# EAGLE design oresat0-plusz-end-cap (EAGLE 9.6.2)
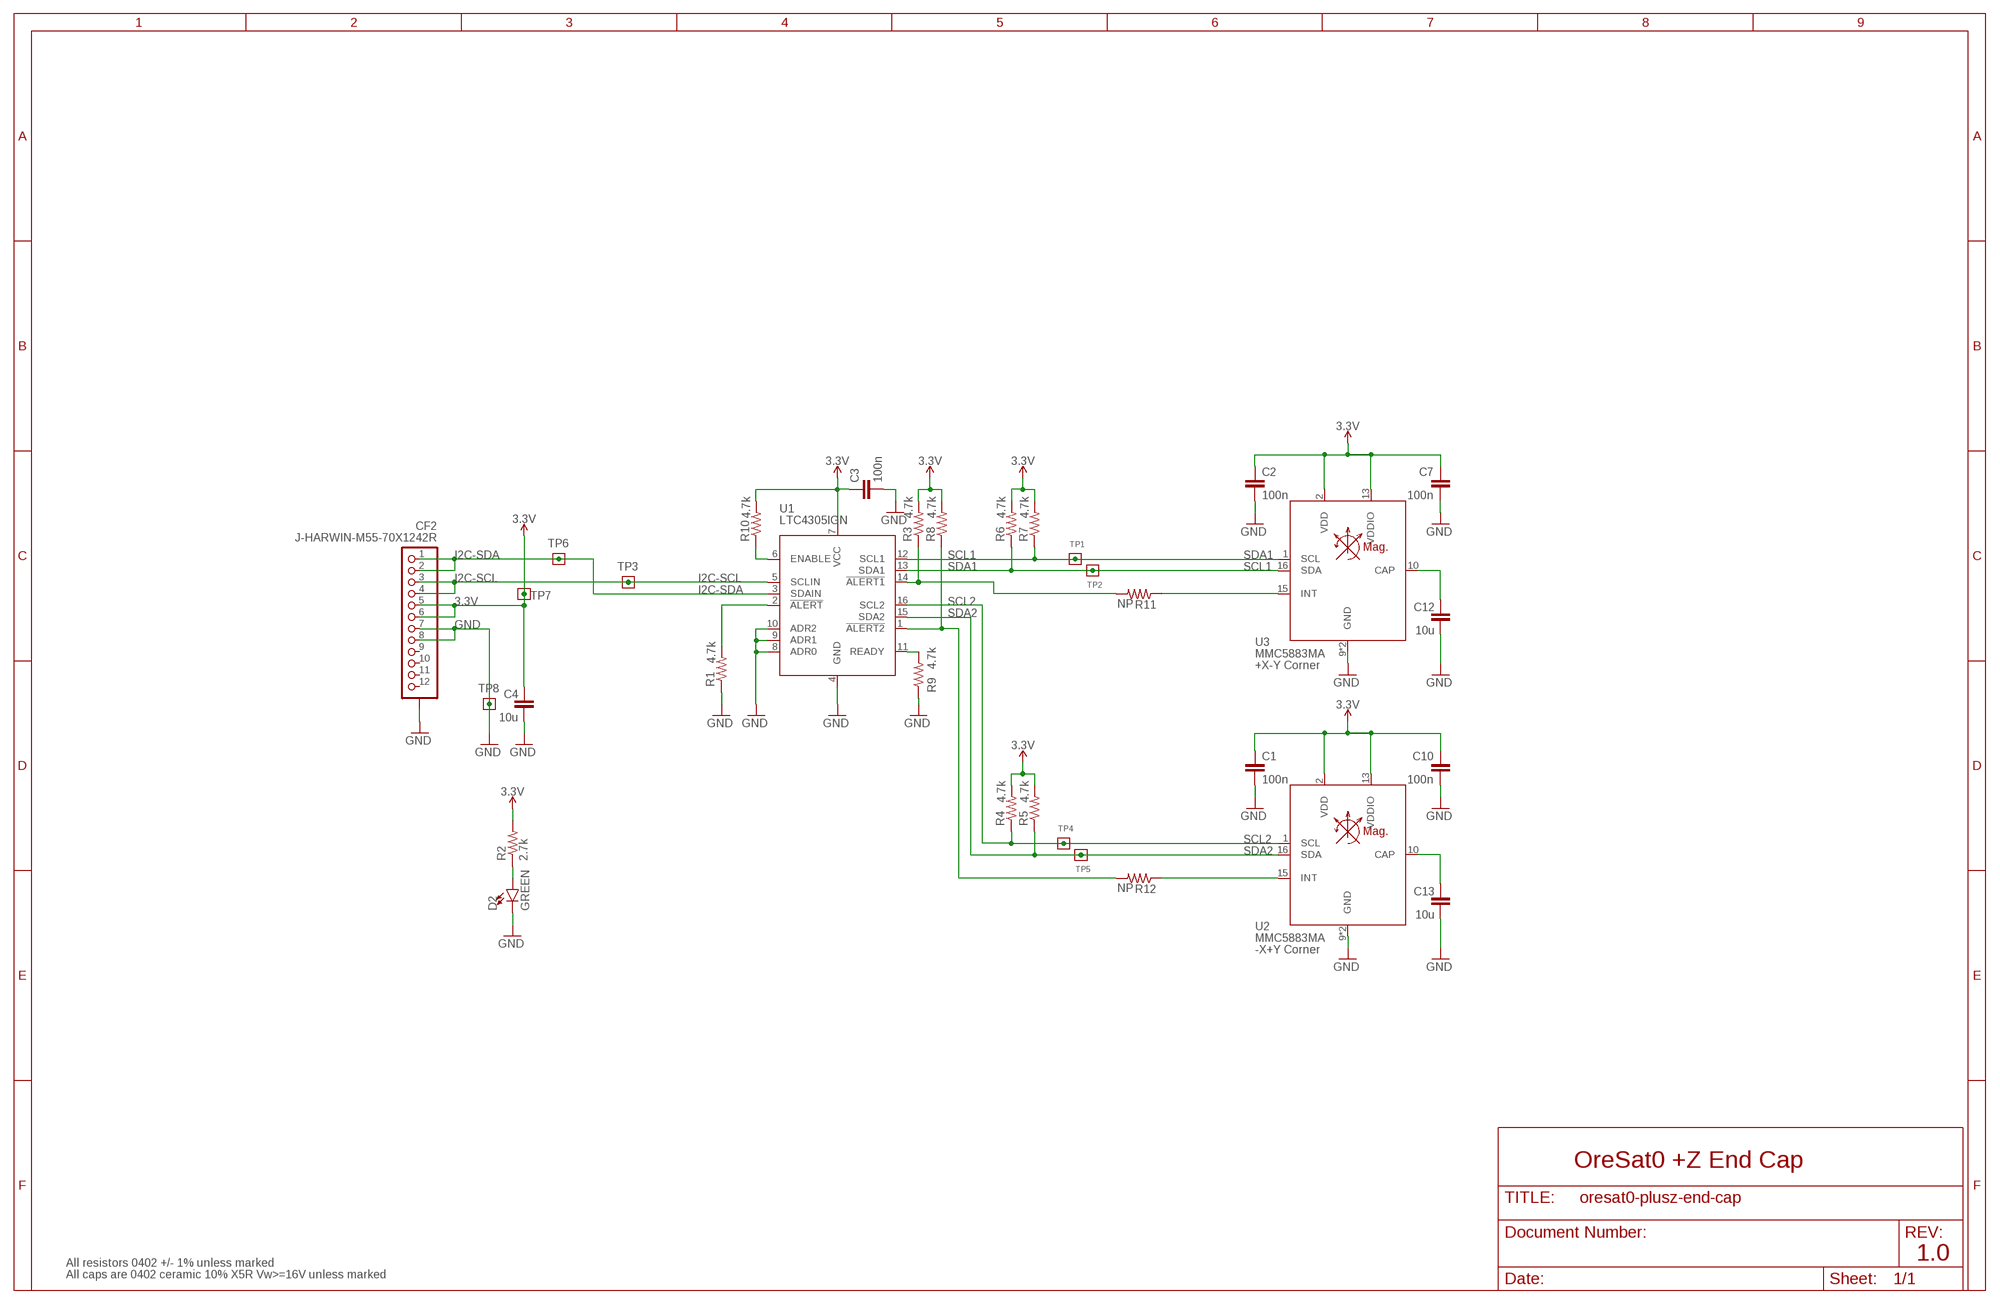
[diagram p0: schematic, sheet 1]

## Parts
C1  100n  C-EU0603-B-NOSILK  [.0603-B-NOSILK]
C2  100n  C-EU0603-B-NOSILK  [.0603-B-NOSILK]
C3  100n  C-EU0603-B-NOSILK  [.0603-B-NOSILK]
C4  10u  C-EU0603-B-NOSILK  [.0603-B-NOSILK]
C7  100n  C-EU0603-B-NOSILK  [.0603-B-NOSILK]
C10  100n  C-EU0603-B-NOSILK  [.0603-B-NOSILK]
C12  10u  C-EU0603-B-NOSILK  [.0603-B-NOSILK]
C13  10u  C-EU0603-B-NOSILK  [.0603-B-NOSILK]
CF2  J-HARWIN-M55-70X1242R  [HARWIN-M55-70X1242R]
D2  GREEN  LED-GREEN0603  [LED-0603]
R1  4.7k  R-US_0603-B-NOSILK  [.0603-B-NOSILK]
R2  2.7k  R-US_0603-B-NOSILK  [.0603-B-NOSILK]
R3  4.7k  R-US_0603-B-NOSILK  [.0603-B-NOSILK]
R4  4.7k  R-US_0603-B-NOSILK  [.0603-B-NOSILK]
R5  4.7k  R-US_0603-B-NOSILK  [.0603-B-NOSILK]
R6  4.7k  R-US_0603-B-NOSILK  [.0603-B-NOSILK]
R7  4.7k  R-US_0603-B-NOSILK  [.0603-B-NOSILK]
R8  4.7k  R-US_0603-B-NOSILK  [.0603-B-NOSILK]
R9  4.7k  R-US_0603-B-NOSILK  [.0603-B-NOSILK]
R10  4.7k  R-US_0603-B-NOSILK  [.0603-B-NOSILK]
R11  NP  R-US_0603-B-NOSILK  [.0603-B-NOSILK]
R12  NP  R-US_0603-B-NOSILK  [.0603-B-NOSILK]
TP1  TEST-POINT-LARGE-SQUARE  [1X01]
TP2  TEST-POINT-LARGE-SQUARE  [1X01]
TP3  TEST-POINT-LARGE-SQUARE  [1X01]
TP4  TEST-POINT-LARGE-SQUARE  [1X01]
TP5  TEST-POINT-LARGE-SQUARE  [1X01]
TP6  TEST-POINT-LARGE-SQUARE  [1X01]
TP7  TEST-POINT-LARGE-SQUARE  [1X01]
TP8  TEST-POINT-LARGE-SQUARE  [1X01]
U1  LTC4305IGN  LTC4305  [16-SSOP]
U2  MMC5883MA  [LGA-16(3X3)]
U3  MMC5883MA  [LGA-16(3X3)]

## Nets
3.3V: C1.1 C2.1 C3.1 C4.1 C7.1 C10.1 CF2.5 CF2.6 R2.2 R3.2 R4.2 R5.2 R6.2 R7.2 R8.2 R10.2 TP7.1 U1.7(VCC) U2.2(VDD) U2.13(VDDIO) U3.2(VDD) U3.13(VDDIO)
GND: C1.2 C2.2 C3.2 C4.2 C7.2 C10.2 C12.2 C13.2 CF2.7 CF2.8 CF2.P$1(SHIELDS) CF2.P$2(SHIELDS) CF2.P$3(SHIELDS) CF2.P$4(SHIELDS) D2.C R1.1 R9.1 TP8.1 U1.4(GND) U1.8(ADR0) U1.9(ADR1) U1.10(ADR2) U2.9(GND) U2.11(GND) U3.9(GND) U3.11(GND)
I2C-SCL: CF2.3 CF2.4 TP3.1 U1.5(SCLIN)
I2C-SDA: CF2.1 CF2.2 TP6.1 U1.3(SDAIN)
N$1: R9.2 U1.11(READY)
N$2: C12.1 U3.10(CAP)
N$3: R1.2 U1.2(!ALERT)
N$4: R3.1 R11.2 U1.14(!ALERT1)
N$5: C13.1 U2.10(CAP)
N$6: R8.1 R12.2 U1.1(!ALERT2)
N$7: R11.1 U3.15(INT)
N$8: R10.1 U1.6(ENABLE)
N$10: R12.1 U2.15(INT)
N$271: D2.A R2.1
SCL1: R7.1 TP1.1 U1.12(SCL1) U3.1(SCL)
SCL2: R4.1 TP4.1 U1.16(SCL2) U2.1(SCL)
SDA1: R6.1 TP2.1 U1.13(SDA1) U3.16(SDA)
SDA2: R5.1 TP5.1 U1.15(SDA2) U2.16(SDA)
Unconnected: CF2.9 CF2.10 CF2.11 CF2.12

## Notes on the sheet
- +X-Y Corner
- -X+Y Corner
- OreSat0 +Z End Cap
- 1.0
- All resistors 0402 +/- 1% unless marked
- All caps are 0402 ceramic 10% X5R Vw>=16V unless marked

## Library data of the parts
C1-C3 C7 C10 = oresat-rcl:C-EU: CAPACITOR, European symbol; DIS: Digi-Key; DPN: 1276-CL10B104KB8NNNLCT-ND; MFR: Samsung; MPN: CL10B104KB8NNNL
C4 C12 C13 = oresat-rcl:C-EU: CAPACITOR, European symbol; DIS: Digi-Key; DPN: 490-14461-1-ND; MFR: Murata; MPN: GRM188D71A106KA73D
CF2 = J-Harwin-M55-70X1242R-12pin-1.27mm-M-vertical:J-HARWIN-M55-70X1242R; DIS: Digi-Key; DPN: A122888-ND; MFR: Harwin; MPN: M55-7011242R
D2 = SparkFun-LED:LED-GREEN: Green SMD LED Used in manufacturing of various products at SparkFun Packages: 0603 - SMD 0603 package [Product Link] <http://www.futureelectronics.com/en/technologies/semiconductors/optoelectronics/leds/Pages/9894312-LTST-C190GKT.aspx?CrossPart=HSMG-C190&IM=0> LilyPad 1206 - SMD1206 LilyPad package [Product Link] <http://www.futureelectronics.com/en/Technologies/Product.aspx?ProductID=IN150NGHARVATEKCORPORATION2049943&IM=0> 1206 - SMD1206 package [Product Link] <http://www.futureelectronics.com/en/technologies/semiconductors/optoelectronics/leds/Pages/8315665-LTST-C150KGKT.aspx?IM=0> 1206 Bottom Mount -SMD 1206 Bottom Mount [Product Link] <http://www.digikey.com/product-detail/en/lite-on-inc/LTST-C230KGKT/160-1456-1-ND/386854> SparkFun Products: Pro Mini 328 -5V <https://www.sparkfun.com/products/821> RedBoard <https://www.sparkfun.com/products/12757> MP3 Trigger <https://www.sparkfun.com/products/13720> Makey Makey <https://www.sparkfun.com/products/11076>; DIS: Digi-Key; DPN: 511-1584-1-ND; MFR: Rohn; MPN: SML-E12M8WT86; PROD_ID: DIO-00821
R1 R3-R10 = oresat-rcl:R-US_: RESISTOR, American symbol; DIS: Digi-Key; DPN: A129696CT-ND; MFR: TE Connectivity; MPN: CRGCQ0603F4K7
R2 = oresat-rcl:R-US_: RESISTOR, American symbol; DIS: Digi-Key; DPN: A129693CT-ND; MFR: TE Connectivity; MPN: CRGCQ0603F2K7
R11 R12 = oresat-rcl:R-US_: RESISTOR, American symbol
TP1-TP8 = oresat-misc:TEST-POINT-LARGE-SQUARE
U1 = U-Linear-LTC4305-2-Channel-Bus-Multiplexer:LTC4305; DIS: Digi-Key; DPN: LTC4305IGN#PBF-ND; MFR: Analog; MPN: LTC4305IGN#PBF
U2 U3 = U-Memsic-MMC5883-3-Axis-Magnetometer:MMC5883MA; DIS: Digi-Key; DPN: 1267-1072-1-ND; MFR: Memsic; MPN: MMC5883MA

## Board
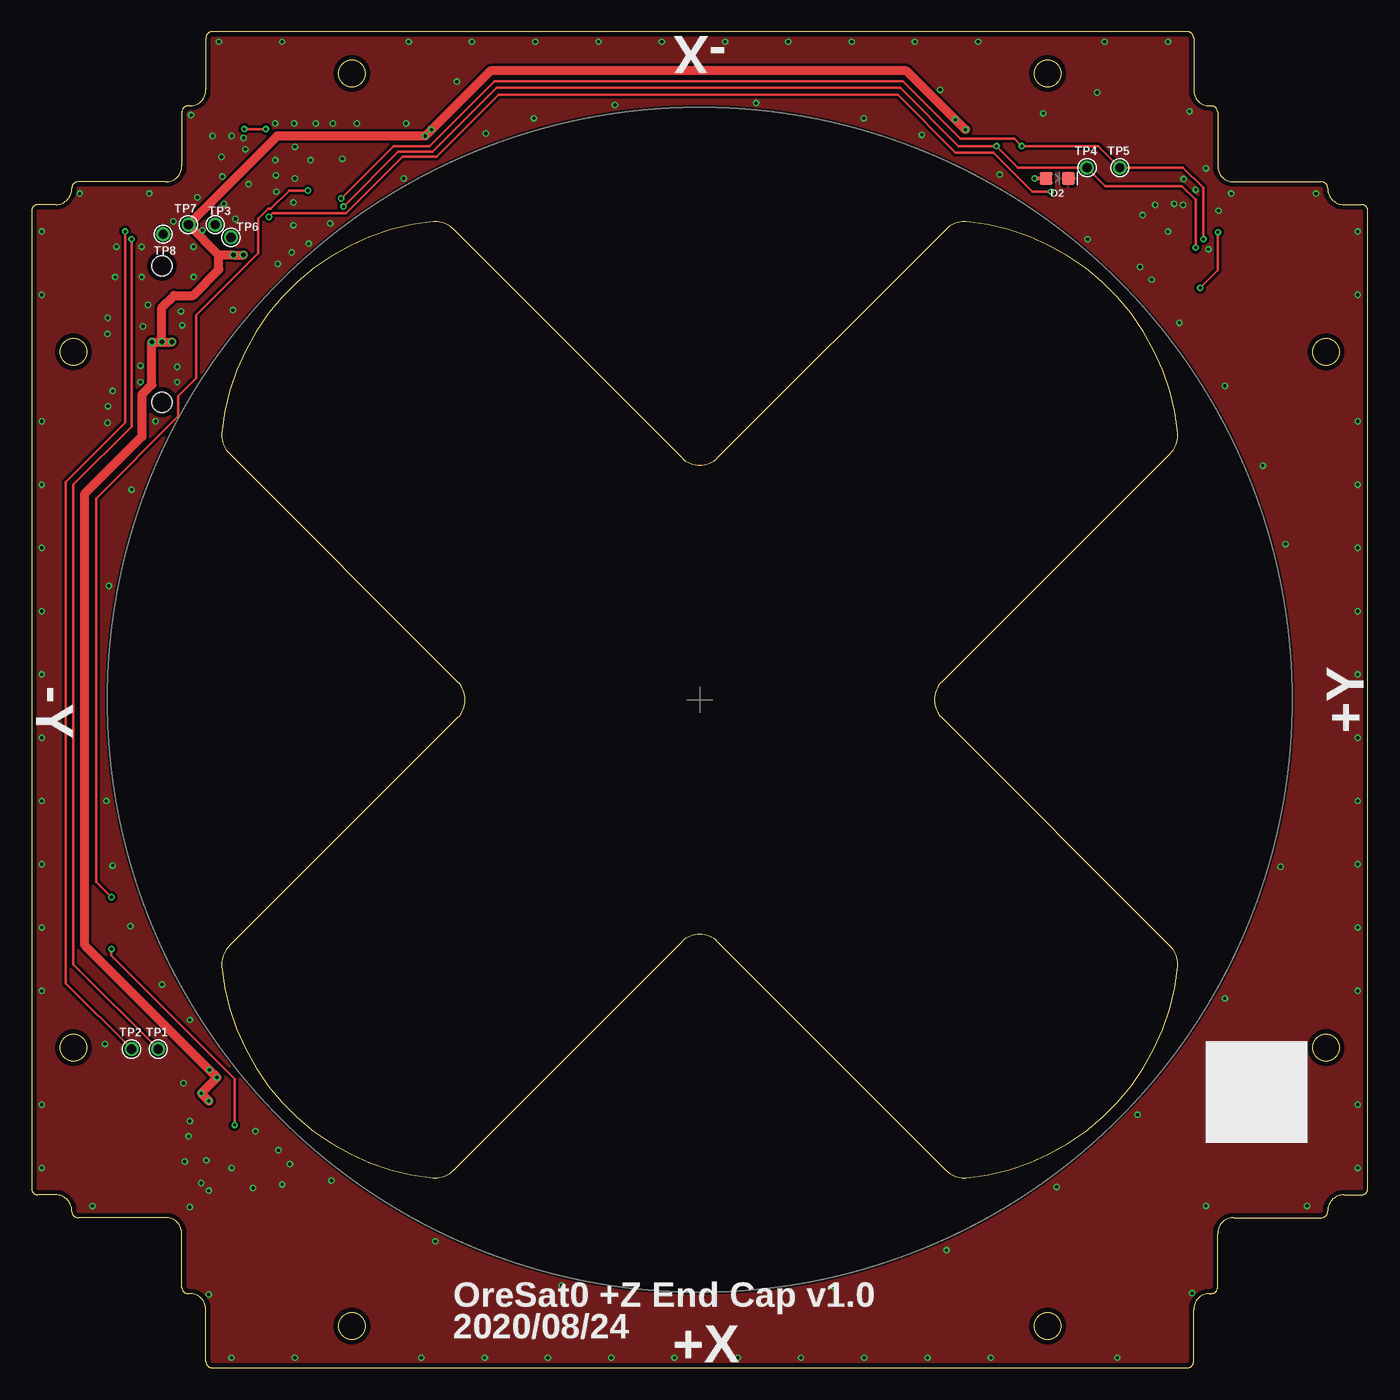
[diagram p1: board, top side]
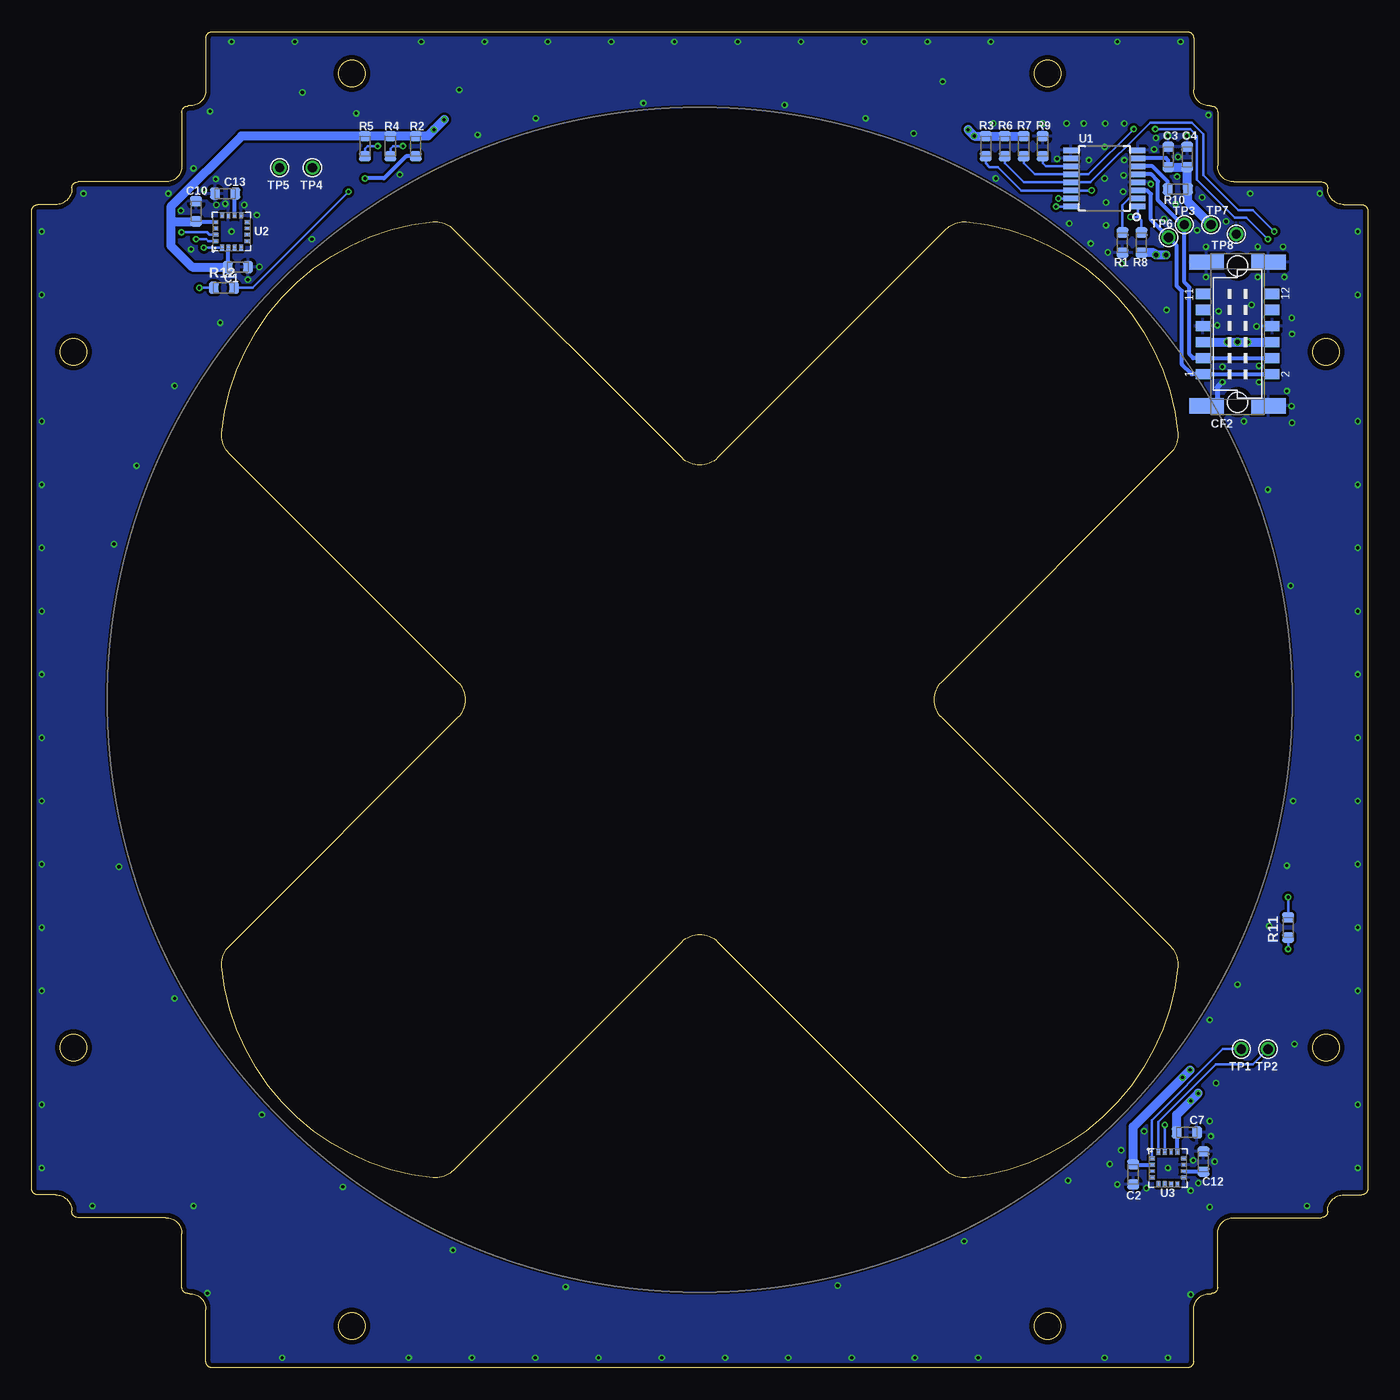
[diagram p2: board, bottom side, seen from below]

Size 105.6 x 105.6 mm. Coordinates in mm from the lower left corner, seen from the top.
Outline: 91.83,105.1 91.83,101 arc90 93.1,99.73 93.23,99.73 arc-90 93.73,99.23 93.73,95 arc90 95,93.73 101.93,93.73 arc-90 102.43,93.23 102.43,93.2 arc90 103.7,91.93 105.1,91.93 arc-90 105.6,91.43 105.6,14.17 arc-90 105.1,13.67 103.7,13.67 arc90 102.43,12.4 102.43,12.37 arc-90 101.93,11.87 95,11.87 arc90 93.73,10.6 93.73,6.37 arc-90 93.23,5.87 93.1,5.87 arc90 91.83,4.6 91.83,0.5 arc-90 91.33,0 14.27,0 arc-90 13.77,0.5 13.77,4.6 arc90 12.5,5.87 12.37,5.87 arc-90 11.87,6.37 11.87,10.6 arc90 10.6,11.87 3.67,11.87 arc-90 3.17,12.37 3.17,12.4 arc90 1.9,13.67 0.5,13.67 arc-90 0,14.17 0,91.43 arc-90 0.5,91.93 1.9,91.93 arc90 3.17,93.2 3.17,93.23 arc-90 3.67,93.73 10.6,93.73 arc90 11.87,95 11.87,99.23 arc-90 12.37,99.73 12.5,99.73 arc90 13.77,101 13.77,105.1 arc-90 14.27,105.6 91.33,105.6 arc-90 91.83,105.1
Outline: 33.67,51.39 15.62,33.33 arc50 15.04,31.73 arc79 31.73,15.04 arc50 33.33,15.62 51.39,33.67 arc-90 54.21,33.67 72.27,15.62 arc50 73.88,15.04 arc79 90.56,31.73 arc50 89.99,33.33 71.93,51.39 arc-90 71.93,54.21 89.98,72.27 arc50 90.56,73.87 arc79 73.88,90.56 arc50 72.27,89.99 54.21,71.93 arc-90 51.39,71.93 33.33,89.98 arc50 31.72,90.56 arc79 15.04,73.88 arc50 15.61,72.28 33.67,54.21 arc-90 33.67,51.39
Outline: circle at 80.3,102.3 radius 1.05
Outline: circle at 102.3,80.3 radius 1.05
Outline: circle at 80.3,3.3 radius 1.05
Outline: circle at 102.3,25.3 radius 1.05
Outline: circle at 3.3,25.3 radius 1.05
Outline: circle at 25.3,3.3 radius 1.05
Outline: circle at 3.3,80.3 radius 1.05
Outline: circle at 25.3,102.3 radius 1.05
Copper layers (1*16): Top 0.035559375mm / dielectric 1.6mm / Bottom 0.035559375mm
Design rules "oshpark-2layer-tented": minimum track width 6mil, minimum drill 10mil, track to track 6mil, track to pad 6mil, pad to pad 6mil, via to via 6mil, smd to smd 6mil, copper to edge 15mil, drill to drill 6mil, minimum pad ring 5mil, minimum via ring 5mil, stop-mask expansion 2.5mil, vias tented up to drill 20mil, thermal gap 10mil
tRestrict: area 6,6 to 99.6,99.6
bRestrict: area 6,6 to 99.6,99.6

### Footprints (pad centres in the part's own frame; a part is rotated, then mirrored left to right if it is on the bottom)
.0603-B-NOSILK = smd 0.8 x 0.95: 1 -0.8,0; 2 0.8,0
HARWIN-M55-70X1242R = smd 0.8 x 1.1: 1 3.175,-2.75; 2 3.175,2.75; 3 1.905,-2.75; 4 1.905,2.75; 5 0.635,-2.75; 6 0.635,2.75; 7 -0.635,-2.75; 8 -0.635,2.75; 9 -1.905,-2.75; 10 -1.905,2.75; 11 -3.175,-2.75; 12 -3.175,2.75 | smd 1.2 x 2.7: P$1 -5.67,-2.45; P$2 -5.67,2.45; P$3 5.67,2.45; P$4 5.67,-2.45 | hole 1.6: -5.385,0; 5.385,0
LED-0603 = smd 1 x 1: A -0.877,0; C 0.877,0
1X01 = drill 0.737 pad 1.1: 1 0,0
16-SSOP = smd 0.419 x 1.143: 1 -2.223,-2.654; 2 -1.587,-2.654; 3 -0.953,-2.654; 4 -0.318,-2.654; 5 0.318,-2.654; 6 0.953,-2.654; 7 1.587,-2.654; 8 2.223,-2.654; 9 2.223,2.654; 10 1.587,2.654; 11 0.953,2.654; 12 0.318,2.654; 13 -0.318,2.654; 14 -0.953,2.654; 15 -1.587,2.654; 16 -2.223,2.654
LGA-16(3X3) = smd 0.3 x 0.45: 1 0.75,1.275; 2 0.25,1.275; 3 -0.25,1.275; 4 -0.75,1.275; 9 -0.75,-1.275; 10 -0.25,-1.275; 11 0.25,-1.275; 12 0.75,-1.275 | smd 0.45 x 0.3: 5 -1.275,0.75; 6 -1.275,0.25; 7 -1.275,-0.25; 8 -1.275,-0.75; 13 1.275,-0.75; 14 1.275,-0.25; 15 1.275,0.25; 16 1.275,0.75

### Placement (x,y rotation side)
C1  89.3,87 0 bottom
C2  18.55,15.3 270 bottom
C3  15.77,95.7 90 bottom
C4  14.27,95.7 90 bottom
C7  14.3,18.6 0 bottom
C10  92.6,91.4 90 bottom
C12  13,16.3 90 bottom
C13  90.3,92.8 180 bottom
CF2  10.3,81.7 270 bottom
D2  81.05,94 0 top
R1  19.4,88.93 90 bottom
R2  75.25,96.55 90 bottom
R3  30.2,96.55 90 bottom
R4  77.25,96.55 90 bottom
R5  79.25,96.55 90 bottom
R6  28.7,96.55 90 bottom
R7  27.2,96.55 90 bottom
R8  17.9,88.93 270 bottom
R9  25.7,96.55 270 bottom
R10  15.02,93.15 0 bottom
R11  4.7k  [.0603-B-NOSILK]  6.3,34.8 90 bottom
R12  4.7k  [.0603-B-NOSILK]  90.4,85.35 0 bottom
TP1  10,25.2 0 top
TP2  7.9,25.2 0 top
TP3  14.5,90.35 270 top
TP4  83.4,94.85 0 top
TP5  86,94.85 0 top
TP6  15.75,89.35 270 top
TP7  12.4,90.35 270 top
TP8  10.4,89.6 180 top
U1  LTC4305  [16-SSOP]  20.82,94 90 bottom
U2  89.8,89.8 180 bottom
U3  15.8,15.8 90 bottom

### Tracks (layer width: path | path; a pad name or v marks a point on that pad's centre or on a via)
3.3V  (via drill 0.25, 0.35)
  Top 0.7: v11.1,81.07 v9.51,81.07 v9.5,81.06 9.5,77.7 8.7,76.9 8.7,73.58 4.2,69.08 4.2,33.4 v14.05,23.55 v14.65,22.95 v13.4,21.7 v14,21.1 | v10.29,81.07 10.29,83.79 11.25,84.75 12.75,84.75 14.8,86.8 14.8,87.95 | v16.75,87.95 v15.95,87.95 14.8,87.95 | 14.8,87.95 TP7.1 19.4,97.35 v31.1,97.35 v31.6,97.85 36.25,102.5 69.15,102.5 v73.8,97.85
  Bottom 0.3: C10.1 92.59,90.55 U2.13 | C1.1 90.05,87.05 U2.2 | U3.13 15.05,18.55 C7.1 | C2.1 18.5,16.05 U3.2 | U1.7 18.15,95.6 15.95,95.6 15.77,95.42 C3.1
  Bottom 0.7: 94.6,90.4 94.6,91.75 89,97.35 R5.2 R4.2 R2.2 74.3,97.35 v73.8,97.85 v73,98.65 | 94.6,90.4 94.6,88.7 92.9,87 C1.1 | CF2.5 v11.11,81.06 v11.1,81.07 v10.29,81.07 v10.28,81.06 CF2.6 | 94.6,90.4 94.4,90.6 C10.1 | R7.2 R6.2 R3.2 v31.1,97.35 v31.6,97.85 | TP7.1 14.22,92.17 R10.2 14.27,93.2 C4.1 C3.1 | v15.95,87.95 v16.75,87.95 16.93,88.13 R8.2 | C2.1 18.55,19.05 v14.05,23.55 | C7.1 15.1,20 v13.4,21.7
GND  (via drill 0.25)
  Bottom 0.4: v11.5,77.9 11.9,77.5 11.9,76.1 11.97,76.03 CF2.P$4
  other vias: 6,74.68 15.8,15.8 14,14 12.1,16.3 12.4,18.3 17.5,14.2 12.5,19.5 12,22.5 19.5,17.2 17.68,18.7 10.3,30.3 5.8,25.6 0.8,15.8 0.8,20.8 0.8,29.8 0.8,34.8 0.8,39.8 0.8,44.8 0.8,49.8 0.8,54.8 0.8,59.8 0.8,64.8 0.8,69.8 0.8,74.8 0.8,89.8 0.8,84.8 104.8,15.8 104.8,20.8 104.8,29.8 104.8,34.8 104.8,39.8 104.8,44.8 104.8,49.8 104.8,54.8 104.8,59.8 104.8,64.8 104.8,69.8 104.8,74.8 104.8,89.8 104.8,84.8 14.8,104.8 19.8,104.8 29.8,104.8 34.8,104.8 39.8,104.8 44.8,104.8 49.8,104.8 54.8,104.8 59.8,104.8 64.8,104.8 69.8,104.8 74.8,104.8 84.8,104.8 89.8,104.8 15.8,0.8 20.8,0.8 30.8,0.8 35.8,0.8 40.8,0.8 45.8,0.8 50.8,0.8 55.8,0.8 60.8,0.8 65.8,0.8 70.8,0.8 75.8,0.8 85.8,0.8 7.8,34.9 7.9,69.4 46.1,99.8 65.75,98.75 70.35,97.45 76.5,94.3 83.45,89.2 90.7,82.6 94.3,77.6 97.3,71.3 99.1,65.1 98.7,39.6 94.3,29.2 87.4,20 81,14.3 72.3,9.3 63.4,6.4 31.9,10 12.5,27.5 89.8,89.8 87.6,87 88.5,86 90.3,92 88.8,91.9 87.8,91.1 20.4,16.1 13.4,14.6 3.8,92.8 12.6,99 91.5,99.3 93.8,91.45 101.5,92.8 100.8,12.8 91.7,5.9 92.8,12.8 14,5.8 8.7,88.6 4.8,12.8 9.8,74.8 6.4,77.2 8.8,82.3 11.9,82.4 11.8,83.5 6.1,61.8 41.9,6.5 6.4,39.7 5.9,44.8 91,91.9 9.3,92.8 9.2,84 6.6,86.2 13.8,16.4 12.8,86.2 8.7,86.2 6.7,88.6 6.04,76 6.01,82.97 91.05,93.95 94.8,92.8 92.8,94.8 19.8,14.5 20.75,98.35 71.8,101 84.2,100.8 79.95,99.15 57.25,99.95 19.35,92.95 19.25,95.45 23.8,98.35 25.7,98.35 24.55,95.55 22.05,95.45 22.45,98.35 19.25,98.35 16.75,97.2 15.8,97.35 14.3,97.35 19.45,87.25 20.55,88.15 21.9,88.85 39.7,98.75 23.7,14.8 15.9,83.6 6,81.7 11.5,79.1 8.6,79.2 29.4,94 19.3,94.25 8.6,77.9 17.15,93.55 92,93.1 93,88.4 12.5,12.7 12.8,88.6 15.07,94.14 15.2,92 16.1,90.8 13.1,92.5 13.5,89.9 11.2,90.6 15,95.7 16.9,96.3 20.8,96.5 20.8,94 20.7,92.1 20.7,90.3 23.6,90.45 35.9,97.55 33.6,101.65 29.6,98.35
  pour Top (isolate 0.2, rank 6): 0,0 105.6,0 105.6,105.6 0,105.6
  pour Bottom (isolate 0.2, rank 6): 0,0 105.6,0 105.6,105.6 0,105.6
I2C-SCL
  Bottom 0.3: CF2.4 CF2.3 13.8,79.8 14.1,80.1 14.1,85.4 14.5,85.8 TP3.1 14.65,90.35 16.58,92.28 16.58,93.78 17.12,94.32 U1.5
I2C-SDA
  Bottom 0.3: CF2.2 CF2.1 13.93,78.53 14.7,79.3 14.7,85.1 15.1,85.5 15.1,88.7 TP6.1 17.15,90.75 17.15,92.76 17.44,93.05 U1.3
N$1
  Bottom 0.2: U1.11 25.45,94.95 25.7,95.2 R9.2
N$2
  Bottom 0.3: U3.10 13.05,15.55 C12.1
N$3
  Bottom 0.2: U1.2 18.89,92.41 19.4,91.9 R1.2
N$4  (via drill 0.25)
  Top 0.2: v6.3,37.2 5.1,38.4 5.1,68.7 11.6,75.2 11.6,76.8 13,78.2 13,83.2 17.9,88.1 17.9,90.82 18.69,91.6 18.9,91.6 20.35,93.05 v21.83,93.05
  Bottom 0.2: R3.1 30.2,95.2 29.9,94.9 29.25,94.9 27.4,93.05 U1.14 v21.83,93.05 | R11.2 v6.3,37.2
N$5
  Bottom 0.3: U2.10 89.55,92.75 C13.1
N$6  (via drill 0.25)
  Top 0.2: v80.55,92.95 79.1,92.95 76,96.05 73,96.05 68.45,100.6 36.9,100.6 32,95.7 29.3,95.7 24.85,91.25 19.05,91.25 v18.75,90.95
  Bottom 0.2: U1.1 18.17,90.98 | 18.17,90.98 17.9,90.71 R8.1 | R12.2 88.15,85.35 v80.55,92.95 | 18.17,90.98 18.19,90.95 v18.75,90.95
N$7  (via drill 0.25)
  Top 0.2: v6.3,33.1 6.3,32.6 16.04,22.86 v16.04,19.2
  Bottom 0.2: U3.15 v16.05,19.19 v16.04,19.2 | R11.1 v6.3,33.1
N$8
  Bottom 0.3: R10.1 15.82,93.75 17.02,94.95 U1.6
N$10  (via drill 0.25)
  Top 0.2: v93.75,89.74 93.75,86.75 v92.35,85.35
  Bottom 0.2: U2.15 91.55,89.55 91.74,89.74 v93.75,89.74 | v92.35,85.35 R12.1
N$271  (via drill 0.25)
  Top 0.3: v79.25,94 D2.A
  Bottom 0.3: R2.1 76,95.75 77.75,94 v79.25,94
SCL1  (via drill 0.25)
  Top 0.2: v7.9,89.2 7.9,74.4 3.3,69.8 3.3,31.9 TP1.1 | v18.5,97.9 v16.8,97.9
  Bottom 0.2: U3.1 17.07,19.57 11.45,25.2 TP1.1 | v16.8,97.9 14.05,97.9 13.5,97.35 13.5,93.9 10.5,90.9 9.6,90.9 v7.9,89.2 | R7.1 27.2,95.2 26.32,94.32 U1.12 22.08,94.32 v18.5,97.9
SCL2  (via drill 0.25)
  Top 0.2: v92,88.53 92,92.3 90.9,93.4 84.85,93.4 TP4.1 77.95,94.85 v76.25,96.55 73.25,96.55 68.65,101.15 36.75,101.15 31.7,96.1 28.97,96.1 v24.65,91.78
  Bottom 0.2: v92,88.53 U2.1 | U1.16 v24.65,91.78 | v76.25,96.55 77.05,96.55 77.25,96.35 R4.1
SDA1  (via drill 0.25)
  Top 0.2: v7.39,89.8 7.39,74.69 2.7,70 2.7,30.4 TP2.1
  Bottom 0.2: U3.16 16.55,19.45 12,24 9.1,24 TP2.1 | v7.39,89.8 v7.4,89.8 9.1,91.5 10.25,91.5 13,94.25 13,97.5 13.91,98.41 17.19,98.41 21.92,93.68 U1.13 27.18,93.68 28.7,95.2 R6.1
SDA2  (via drill 0.25)
  Top 0.2: v92.6,89.2 92.6,93.25 90.99,94.86 TP5.1 84.3,96.55 v78.25,96.55 77.65,97.15 73.4,97.15 68.85,101.7 36.6,101.7 31.45,96.55 28.6,96.55 v24.46,92.41
  Bottom 0.2: v92.6,89.2 91.8,89.2 91.65,89.05 U2.16 | v24.46,92.41 U1.15 | v78.25,96.55 79.05,96.55 79.25,96.35 R5.1

### Text on the board
tPlace: -X | +Y | -Y | OreSat0 +Z End Cap v1.0 | 2020/08/24 | +X